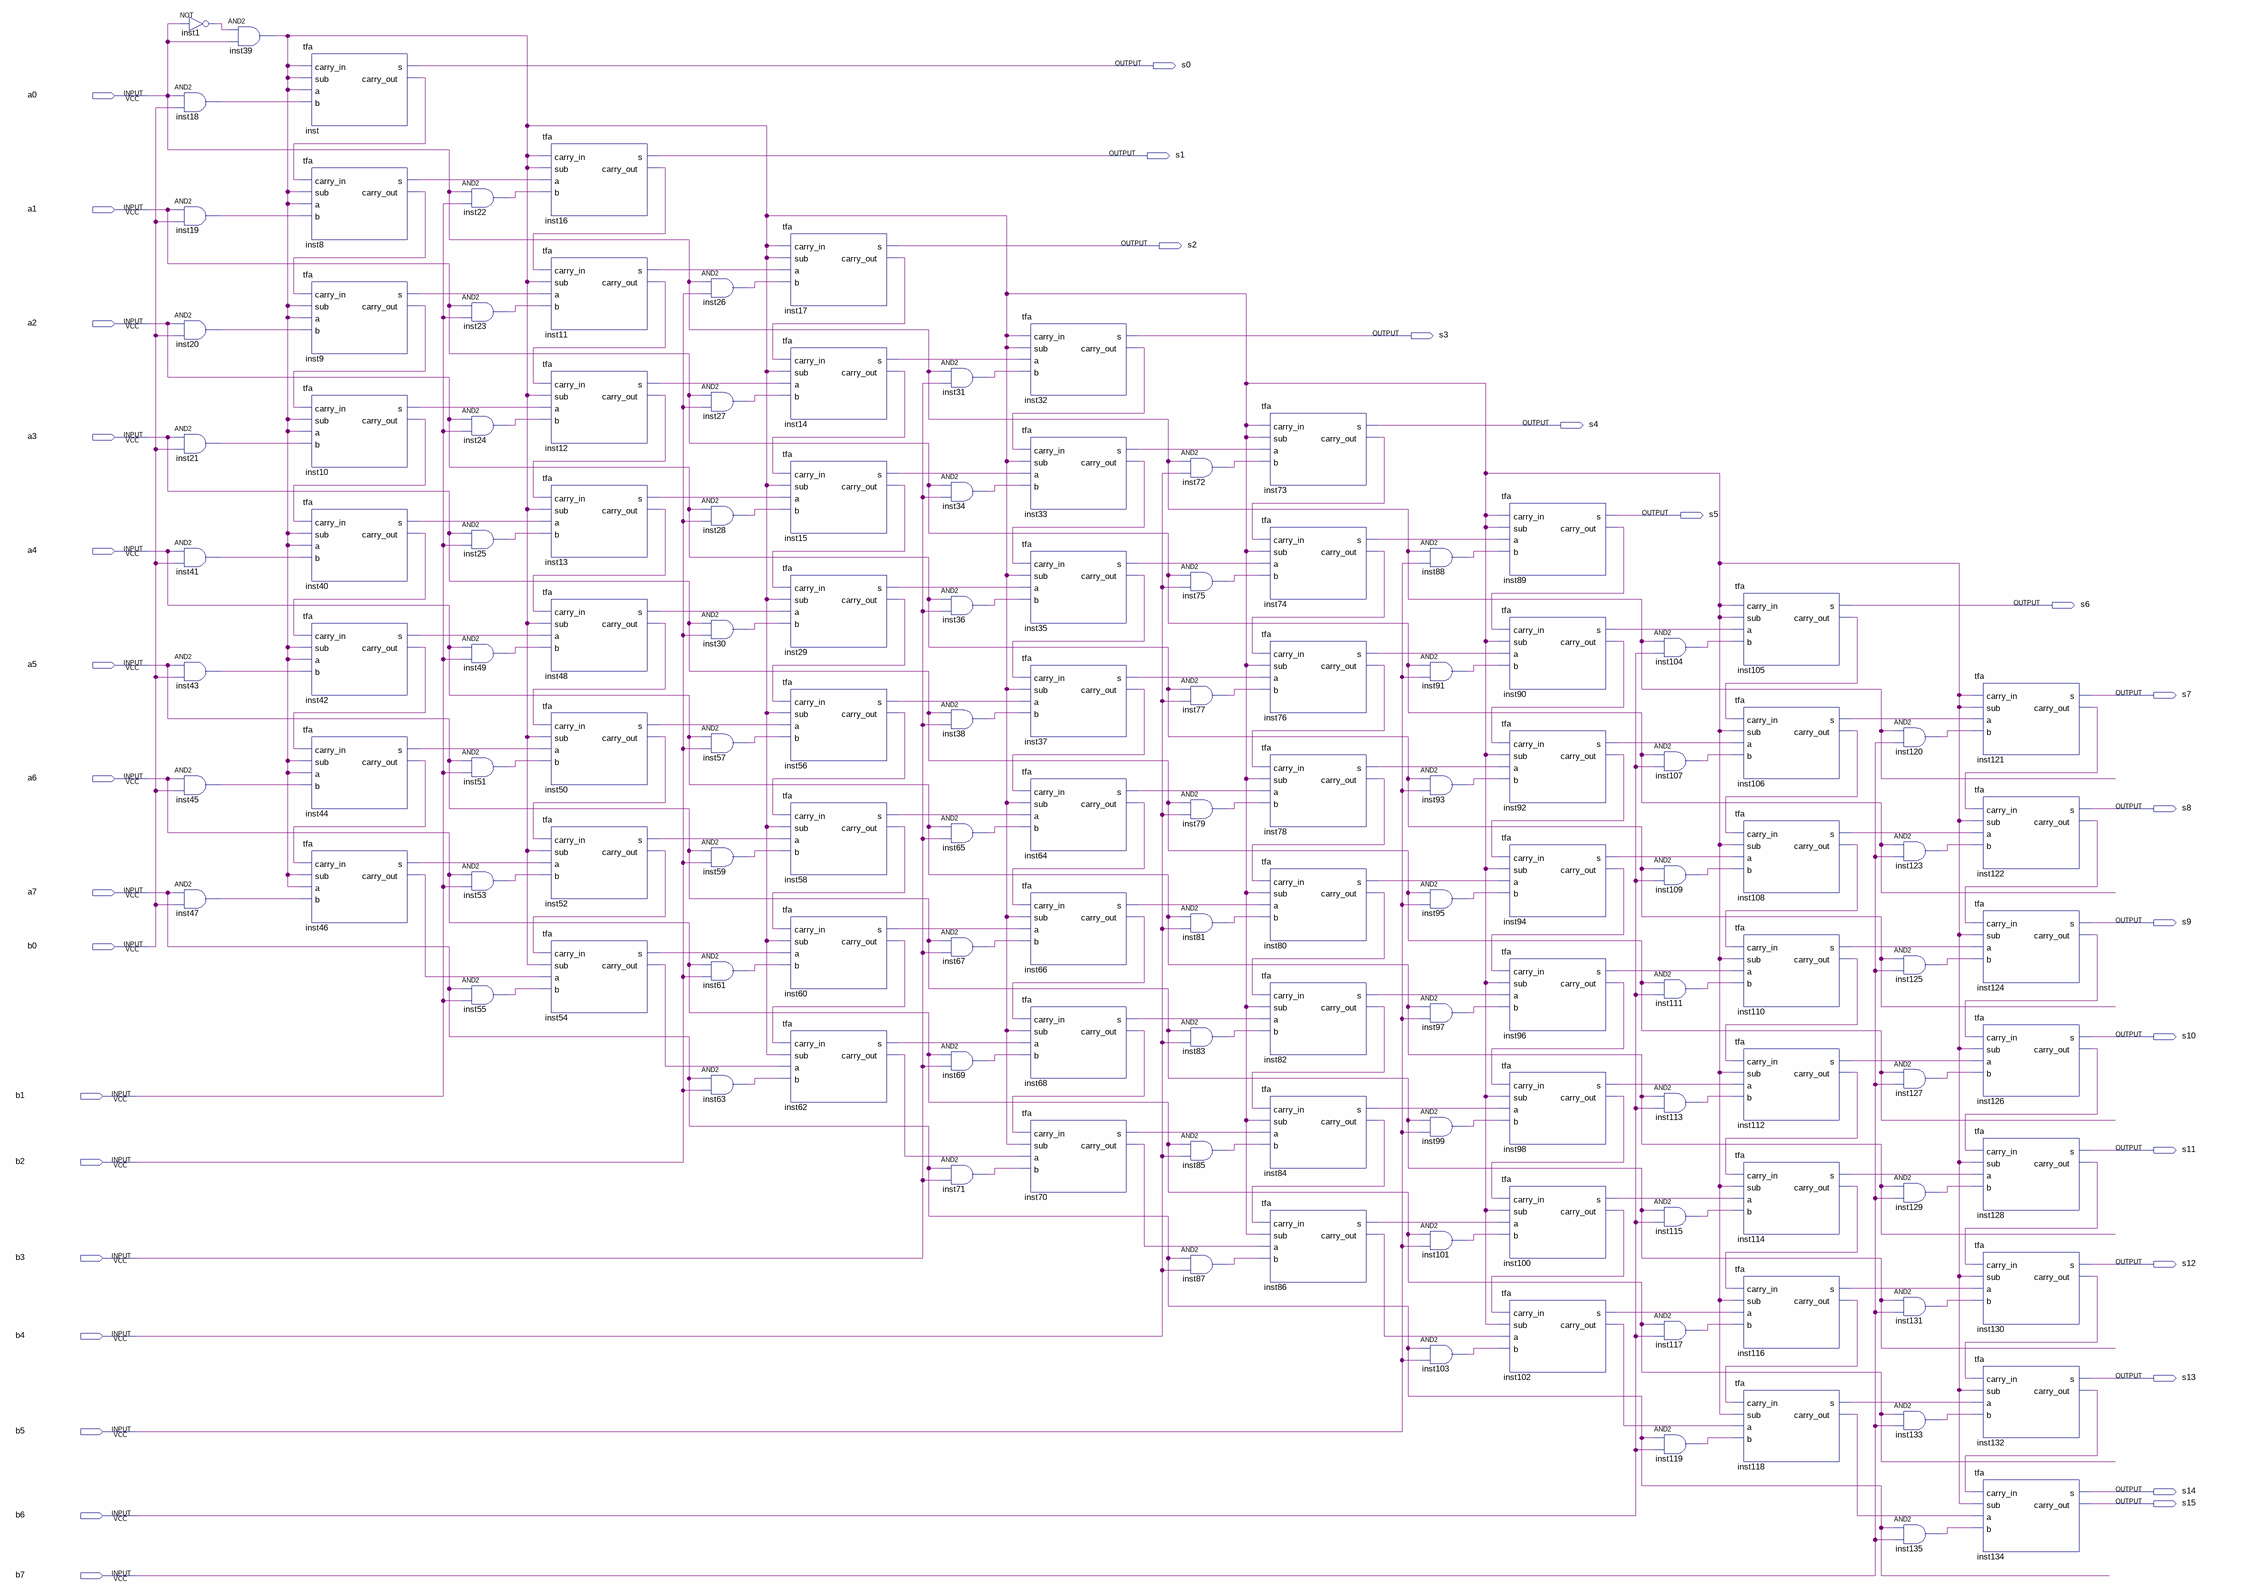
[diagram p0: schematic sheet]
// Quartus schematic wfhcfq.bdf as structural Verilog: 130 symbols, 32 pins
module wfhcfq (
  input  a0,
  input  a1,
  input  a2,
  input  a3,
  input  a4,
  input  a5,
  input  a6,
  input  a7,
  input  b0,
  input  b1,
  input  b2,
  input  b3,
  input  b4,
  input  b5,
  input  b6,
  input  b7,
  output s0,
  output s1,
  output s2,
  output s3,
  output s4,
  output s5,
  output s6,
  output s7,
  output s8,
  output s9,
  output s10,
  output s11,
  output s12,
  output s13,
  output s14,
  output s15
);

  wire inst1_out, inst8_carry_out, inst8_s, inst9_carry_out, inst9_s, inst10_carry_out, inst10_s,
       inst11_carry_out, inst11_s, inst12_carry_out, inst12_s, inst13_carry_out, inst13_s, inst14_carry_out,
       inst14_s, inst15_carry_out, inst15_s, inst16_carry_out, inst17_carry_out, inst18_out, inst19_out,
       inst20_out, inst21_out, inst22_out, inst23_out, inst24_out, inst25_out, inst26_out, inst27_out,
       inst28_out, inst29_carry_out, inst29_s, inst30_out, inst31_out, inst32_carry_out, inst33_carry_out,
       inst33_s, inst34_out, inst35_carry_out, inst35_s, inst36_out, inst37_carry_out, inst37_s, inst38_out,
       inst39_out, inst40_carry_out, inst40_s, inst41_out, inst42_carry_out, inst42_s, inst43_out,
       inst44_carry_out, inst44_s, inst45_out, inst46_carry_out, inst46_s, inst47_out, inst48_carry_out,
       inst48_s, inst49_out, inst50_carry_out, inst50_s, inst51_out, inst52_carry_out, inst52_s, inst53_out,
       inst54_carry_out, inst54_s, inst55_out, inst56_carry_out, inst56_s, inst57_out, inst58_carry_out,
       inst58_s, inst59_out, inst60_carry_out, inst60_s, inst61_out, inst62_carry_out, inst62_s, inst63_out,
       inst64_carry_out, inst64_s, inst65_out, inst66_carry_out, inst66_s, inst67_out, inst68_carry_out,
       inst68_s, inst69_out, inst70_carry_out, inst70_s, inst71_out, inst72_out, inst73_carry_out,
       inst74_carry_out, inst74_s, inst75_out, inst76_carry_out, inst76_s, inst77_out, inst78_carry_out,
       inst78_s, inst79_out, inst80_carry_out, inst80_s, inst81_out, inst82_carry_out, inst82_s, inst83_out,
       inst84_carry_out, inst84_s, inst85_out, inst86_carry_out, inst86_s, inst87_out, inst88_out,
       inst89_carry_out, inst90_carry_out, inst90_s, inst91_out, inst92_carry_out, inst92_s, inst93_out,
       inst94_carry_out, inst94_s, inst95_out, inst96_carry_out, inst96_s, inst97_out, inst98_carry_out,
       inst98_s, inst99_out, inst100_carry_out, inst100_s, inst101_out, inst102_carry_out, inst102_s,
       inst103_out, inst104_out, inst105_carry_out, inst106_carry_out, inst106_s, inst107_out,
       inst108_carry_out, inst108_s, inst109_out, inst110_carry_out, inst110_s, inst111_out,
       inst112_carry_out, inst112_s, inst113_out, inst114_carry_out, inst114_s, inst115_out,
       inst116_carry_out, inst116_s, inst117_out, inst118_carry_out, inst118_s, inst119_out, inst120_out,
       inst121_carry_out, inst122_carry_out, inst123_out, inst124_carry_out, inst125_out, inst126_carry_out,
       inst127_out, inst128_carry_out, inst129_out, inst130_carry_out, inst131_out, inst132_carry_out,
       inst133_out, inst135_out, inst_carry_out;

  not inst1 (inst1_out, a0);
  and inst18 (inst18_out, a0, b0);
  and inst19 (inst19_out, a1, b0);
  and inst20 (inst20_out, a2, b0);
  and inst21 (inst21_out, a3, b0);
  and inst41 (inst41_out, a4, b0);
  and inst43 (inst43_out, a5, b0);
  and inst45 (inst45_out, a6, b0);
  and inst47 (inst47_out, a7, b0);
  and inst39 (inst39_out, inst1_out, a0);
  tfa inst (
    .carry_in(inst39_out), .sub(inst39_out), .a(inst39_out), .b(inst18_out), .s(s0),
    .carry_out(inst_carry_out));
  tfa inst8 (
    .carry_in(inst_carry_out), .sub(inst39_out), .a(inst39_out), .b(inst19_out), .s(inst8_s),
    .carry_out(inst8_carry_out));
  tfa inst9 (
    .carry_in(inst8_carry_out), .sub(inst39_out), .a(inst39_out), .b(inst20_out), .s(inst9_s),
    .carry_out(inst9_carry_out));
  tfa inst10 (
    .carry_in(inst9_carry_out), .sub(inst39_out), .a(inst39_out), .b(inst21_out), .s(inst10_s),
    .carry_out(inst10_carry_out));
  tfa inst40 (
    .carry_in(inst10_carry_out), .sub(inst39_out), .a(inst39_out), .b(inst41_out), .s(inst40_s),
    .carry_out(inst40_carry_out));
  tfa inst42 (
    .carry_in(inst40_carry_out), .sub(inst39_out), .a(inst39_out), .b(inst43_out), .s(inst42_s),
    .carry_out(inst42_carry_out));
  tfa inst44 (
    .carry_in(inst42_carry_out), .sub(inst39_out), .a(inst39_out), .b(inst45_out), .s(inst44_s),
    .carry_out(inst44_carry_out));
  tfa inst46 (
    .carry_in(inst44_carry_out), .sub(inst39_out), .a(inst39_out), .b(inst47_out), .s(inst46_s),
    .carry_out(inst46_carry_out));
  and inst22 (inst22_out, a0, b1);
  and inst23 (inst23_out, a1, b1);
  and inst24 (inst24_out, a2, b1);
  and inst25 (inst25_out, a3, b1);
  and inst49 (inst49_out, a4, b1);
  and inst51 (inst51_out, a5, b1);
  and inst53 (inst53_out, a6, b1);
  and inst55 (inst55_out, a7, b1);
  tfa inst16 (
    .carry_in(inst39_out), .sub(inst39_out), .a(inst8_s), .b(inst22_out), .s(s1), .carry_out(inst16_carry_out));
  tfa inst11 (
    .carry_in(inst16_carry_out), .sub(inst39_out), .a(inst9_s), .b(inst23_out), .s(inst11_s),
    .carry_out(inst11_carry_out));
  tfa inst12 (
    .carry_in(inst11_carry_out), .sub(inst39_out), .a(inst10_s), .b(inst24_out), .s(inst12_s),
    .carry_out(inst12_carry_out));
  tfa inst13 (
    .carry_in(inst12_carry_out), .sub(inst39_out), .a(inst40_s), .b(inst25_out), .s(inst13_s),
    .carry_out(inst13_carry_out));
  tfa inst48 (
    .carry_in(inst13_carry_out), .sub(inst39_out), .a(inst42_s), .b(inst49_out), .s(inst48_s),
    .carry_out(inst48_carry_out));
  tfa inst50 (
    .carry_in(inst48_carry_out), .sub(inst39_out), .a(inst44_s), .b(inst51_out), .s(inst50_s),
    .carry_out(inst50_carry_out));
  tfa inst52 (
    .carry_in(inst50_carry_out), .sub(inst39_out), .a(inst46_s), .b(inst53_out), .s(inst52_s),
    .carry_out(inst52_carry_out));
  tfa inst54 (
    .carry_in(inst52_carry_out), .sub(inst39_out), .a(inst46_carry_out), .b(inst55_out), .s(inst54_s),
    .carry_out(inst54_carry_out));
  and inst26 (inst26_out, a0, b2);
  and inst27 (inst27_out, a1, b2);
  and inst28 (inst28_out, a2, b2);
  and inst30 (inst30_out, a3, b2);
  and inst57 (inst57_out, a4, b2);
  and inst59 (inst59_out, a5, b2);
  and inst61 (inst61_out, a6, b2);
  and inst63 (inst63_out, a7, b2);
  tfa inst17 (
    .carry_in(inst39_out), .sub(inst39_out), .a(inst11_s), .b(inst26_out), .s(s2),
    .carry_out(inst17_carry_out));
  tfa inst14 (
    .carry_in(inst17_carry_out), .sub(inst39_out), .a(inst12_s), .b(inst27_out), .s(inst14_s),
    .carry_out(inst14_carry_out));
  tfa inst15 (
    .carry_in(inst14_carry_out), .sub(inst39_out), .a(inst13_s), .b(inst28_out), .s(inst15_s),
    .carry_out(inst15_carry_out));
  tfa inst29 (
    .carry_in(inst15_carry_out), .sub(inst39_out), .a(inst48_s), .b(inst30_out), .s(inst29_s),
    .carry_out(inst29_carry_out));
  tfa inst56 (
    .carry_in(inst29_carry_out), .sub(inst39_out), .a(inst50_s), .b(inst57_out), .s(inst56_s),
    .carry_out(inst56_carry_out));
  tfa inst58 (
    .carry_in(inst56_carry_out), .sub(inst39_out), .a(inst52_s), .b(inst59_out), .s(inst58_s),
    .carry_out(inst58_carry_out));
  tfa inst60 (
    .carry_in(inst58_carry_out), .sub(inst39_out), .a(inst54_s), .b(inst61_out), .s(inst60_s),
    .carry_out(inst60_carry_out));
  tfa inst62 (
    .carry_in(inst60_carry_out), .sub(inst39_out), .a(inst54_carry_out), .b(inst63_out), .s(inst62_s),
    .carry_out(inst62_carry_out));
  and inst31 (inst31_out, a0, b3);
  and inst34 (inst34_out, a1, b3);
  and inst36 (inst36_out, a2, b3);
  and inst38 (inst38_out, a3, b3);
  and inst65 (inst65_out, a4, b3);
  and inst67 (inst67_out, a5, b3);
  and inst69 (inst69_out, a6, b3);
  and inst71 (inst71_out, a7, b3);
  tfa inst32 (
    .carry_in(inst39_out), .sub(inst39_out), .a(inst14_s), .b(inst31_out), .s(s3),
    .carry_out(inst32_carry_out));
  tfa inst33 (
    .carry_in(inst32_carry_out), .sub(inst39_out), .a(inst15_s), .b(inst34_out), .s(inst33_s),
    .carry_out(inst33_carry_out));
  tfa inst35 (
    .carry_in(inst33_carry_out), .sub(inst39_out), .a(inst29_s), .b(inst36_out), .s(inst35_s),
    .carry_out(inst35_carry_out));
  tfa inst37 (
    .carry_in(inst35_carry_out), .sub(inst39_out), .a(inst56_s), .b(inst38_out), .s(inst37_s),
    .carry_out(inst37_carry_out));
  tfa inst64 (
    .carry_in(inst37_carry_out), .sub(inst39_out), .a(inst58_s), .b(inst65_out), .s(inst64_s),
    .carry_out(inst64_carry_out));
  tfa inst66 (
    .carry_in(inst64_carry_out), .sub(inst39_out), .a(inst60_s), .b(inst67_out), .s(inst66_s),
    .carry_out(inst66_carry_out));
  tfa inst68 (
    .carry_in(inst66_carry_out), .sub(inst39_out), .a(inst62_s), .b(inst69_out), .s(inst68_s),
    .carry_out(inst68_carry_out));
  tfa inst70 (
    .carry_in(inst68_carry_out), .sub(inst39_out), .a(inst62_carry_out), .b(inst71_out), .s(inst70_s),
    .carry_out(inst70_carry_out));
  and inst72 (inst72_out, a0, b4);
  and inst75 (inst75_out, a1, b4);
  and inst77 (inst77_out, a2, b4);
  and inst79 (inst79_out, a3, b4);
  and inst81 (inst81_out, a4, b4);
  and inst83 (inst83_out, a5, b4);
  and inst85 (inst85_out, a6, b4);
  and inst87 (inst87_out, a7, b4);
  tfa inst73 (
    .carry_in(inst39_out), .sub(inst39_out), .a(inst33_s), .b(inst72_out), .s(s4),
    .carry_out(inst73_carry_out));
  tfa inst74 (
    .carry_in(inst73_carry_out), .sub(inst39_out), .a(inst35_s), .b(inst75_out), .s(inst74_s),
    .carry_out(inst74_carry_out));
  tfa inst76 (
    .carry_in(inst74_carry_out), .sub(inst39_out), .a(inst37_s), .b(inst77_out), .s(inst76_s),
    .carry_out(inst76_carry_out));
  tfa inst78 (
    .carry_in(inst76_carry_out), .sub(inst39_out), .a(inst64_s), .b(inst79_out), .s(inst78_s),
    .carry_out(inst78_carry_out));
  tfa inst80 (
    .carry_in(inst78_carry_out), .sub(inst39_out), .a(inst66_s), .b(inst81_out), .s(inst80_s),
    .carry_out(inst80_carry_out));
  tfa inst82 (
    .carry_in(inst80_carry_out), .sub(inst39_out), .a(inst68_s), .b(inst83_out), .s(inst82_s),
    .carry_out(inst82_carry_out));
  tfa inst84 (
    .carry_in(inst82_carry_out), .sub(inst39_out), .a(inst70_s), .b(inst85_out), .s(inst84_s),
    .carry_out(inst84_carry_out));
  tfa inst86 (
    .carry_in(inst84_carry_out), .sub(inst39_out), .a(inst70_carry_out), .b(inst87_out), .s(inst86_s),
    .carry_out(inst86_carry_out));
  and inst88 (inst88_out, a0, b5);
  and inst91 (inst91_out, a1, b5);
  and inst93 (inst93_out, a2, b5);
  and inst95 (inst95_out, a3, b5);
  and inst97 (inst97_out, a4, b5);
  and inst99 (inst99_out, a5, b5);
  and inst101 (inst101_out, a6, b5);
  and inst103 (inst103_out, a7, b5);
  tfa inst89 (
    .carry_in(inst39_out), .sub(inst39_out), .a(inst74_s), .b(inst88_out), .s(s5),
    .carry_out(inst89_carry_out));
  tfa inst90 (
    .carry_in(inst89_carry_out), .sub(inst39_out), .a(inst76_s), .b(inst91_out), .s(inst90_s),
    .carry_out(inst90_carry_out));
  tfa inst92 (
    .carry_in(inst90_carry_out), .sub(inst39_out), .a(inst78_s), .b(inst93_out), .s(inst92_s),
    .carry_out(inst92_carry_out));
  tfa inst94 (
    .carry_in(inst92_carry_out), .sub(inst39_out), .a(inst80_s), .b(inst95_out), .s(inst94_s),
    .carry_out(inst94_carry_out));
  tfa inst96 (
    .carry_in(inst94_carry_out), .sub(inst39_out), .a(inst82_s), .b(inst97_out), .s(inst96_s),
    .carry_out(inst96_carry_out));
  tfa inst98 (
    .carry_in(inst96_carry_out), .sub(inst39_out), .a(inst84_s), .b(inst99_out), .s(inst98_s),
    .carry_out(inst98_carry_out));
  tfa inst100 (
    .carry_in(inst98_carry_out), .sub(inst39_out), .a(inst86_s), .b(inst101_out), .s(inst100_s),
    .carry_out(inst100_carry_out));
  tfa inst102 (
    .carry_in(inst100_carry_out), .sub(inst39_out), .a(inst86_carry_out), .b(inst103_out), .s(inst102_s),
    .carry_out(inst102_carry_out));
  and inst104 (inst104_out, a0, b6);
  and inst107 (inst107_out, a1, b6);
  and inst109 (inst109_out, a2, b6);
  and inst111 (inst111_out, a3, b6);
  and inst113 (inst113_out, a4, b6);
  and inst115 (inst115_out, a5, b6);
  and inst117 (inst117_out, a6, b6);
  and inst119 (inst119_out, a7, b6);
  tfa inst105 (
    .carry_in(inst39_out), .sub(inst39_out), .a(inst90_s), .b(inst104_out), .s(s6),
    .carry_out(inst105_carry_out));
  tfa inst106 (
    .carry_in(inst105_carry_out), .sub(inst39_out), .a(inst92_s), .b(inst107_out), .s(inst106_s),
    .carry_out(inst106_carry_out));
  tfa inst108 (
    .carry_in(inst106_carry_out), .sub(inst39_out), .a(inst94_s), .b(inst109_out), .s(inst108_s),
    .carry_out(inst108_carry_out));
  tfa inst110 (
    .carry_in(inst108_carry_out), .sub(inst39_out), .a(inst96_s), .b(inst111_out), .s(inst110_s),
    .carry_out(inst110_carry_out));
  tfa inst112 (
    .carry_in(inst110_carry_out), .sub(inst39_out), .a(inst98_s), .b(inst113_out), .s(inst112_s),
    .carry_out(inst112_carry_out));
  tfa inst114 (
    .carry_in(inst112_carry_out), .sub(inst39_out), .a(inst100_s), .b(inst115_out), .s(inst114_s),
    .carry_out(inst114_carry_out));
  tfa inst116 (
    .carry_in(inst114_carry_out), .sub(inst39_out), .a(inst102_s), .b(inst117_out), .s(inst116_s),
    .carry_out(inst116_carry_out));
  tfa inst118 (
    .carry_in(inst116_carry_out), .sub(inst39_out), .a(inst102_carry_out), .b(inst119_out), .s(inst118_s),
    .carry_out(inst118_carry_out));
  and inst120 (inst120_out, a0, b7);
  and inst123 (inst123_out, a1, b7);
  and inst125 (inst125_out, a2, b7);
  and inst127 (inst127_out, a3, b7);
  and inst129 (inst129_out, a4, b7);
  and inst131 (inst131_out, a5, b7);
  and inst133 (inst133_out, a6, b7);
  and inst135 (inst135_out, a7, b7);
  tfa inst121 (
    .carry_in(inst39_out), .sub(inst39_out), .a(inst106_s), .b(inst120_out), .s(s7),
    .carry_out(inst121_carry_out));
  tfa inst122 (
    .carry_in(inst121_carry_out), .sub(inst39_out), .a(inst108_s), .b(inst123_out), .s(s8),
    .carry_out(inst122_carry_out));
  tfa inst124 (
    .carry_in(inst122_carry_out), .sub(inst39_out), .a(inst110_s), .b(inst125_out), .s(s9),
    .carry_out(inst124_carry_out));
  tfa inst126 (
    .carry_in(inst124_carry_out), .sub(inst39_out), .a(inst112_s), .b(inst127_out), .s(s10),
    .carry_out(inst126_carry_out));
  tfa inst128 (
    .carry_in(inst126_carry_out), .sub(inst39_out), .a(inst114_s), .b(inst129_out), .s(s11),
    .carry_out(inst128_carry_out));
  tfa inst130 (
    .carry_in(inst128_carry_out), .sub(inst39_out), .a(inst116_s), .b(inst131_out), .s(s12),
    .carry_out(inst130_carry_out));
  tfa inst132 (
    .carry_in(inst130_carry_out), .sub(inst39_out), .a(inst118_s), .b(inst133_out), .s(s13),
    .carry_out(inst132_carry_out));
  tfa inst134 (
    .carry_in(inst132_carry_out), .sub(inst39_out), .a(inst118_carry_out), .b(inst135_out), .s(s14),
    .carry_out(s15));
endmodule
